# Altium schematic sheet Power2.SchDoc
size A3
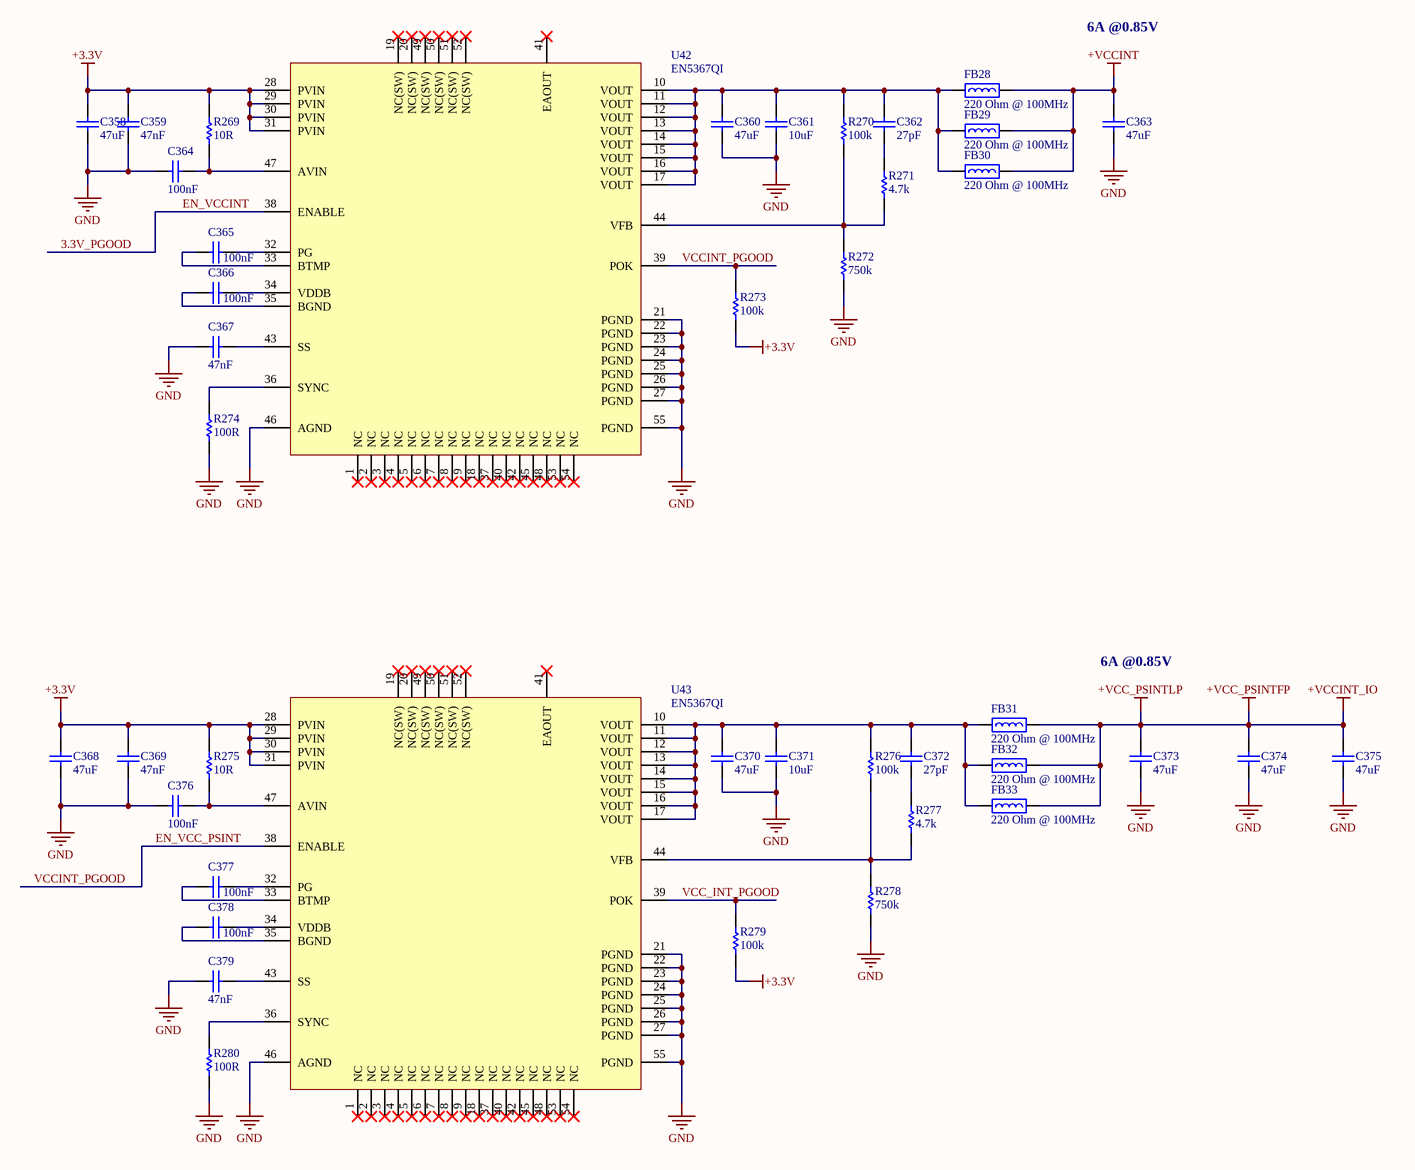
[diagram p0: Power2.SchDoc]

## Parts
C358  47uF  [CAPC3216L_1206]
C359  47nF  [CAPC2012L_0805]
C360  47uF  [CAPC3216L_1206]
C361  10uF  [CAPC1005L_0402]
C362  27pF  [CAPC1005L_0402]
C363  47uF  [CAPC3216L_1206]
C364  100nF  [CAPC1005L_0402]
C365  100nF  [CAPC1005L_0402]
C366  100nF  [CAPC1005L_0402]
C367  47nF  [CAPC2012L_0805]
C368  47uF  [CAPC3216L_1206]
C369  47nF  [CAPC2012L_0805]
C370  47uF  [CAPC3216L_1206]
C371  10uF  [CAPC1005L_0402]
C372  27pF  [CAPC1005L_0402]
C373  47uF  [CAPC3216L_1206]
C374  47uF  [CAPC3216L_1206]
C375  47uF  [CAPC3216L_1206]
C376  100nF  [CAPC1005L_0402]
C377  100nF  [CAPC1005L_0402]
C378  100nF  [CAPC1005L_0402]
C379  47nF  [CAPC2012L_0805]
FB28  Impedance @ Frequency: 220 Ohm @ 100MHz  [INDC1608N_0603]  (hidden comment: BEAD0603_220_2A5_40M)
FB29  Impedance @ Frequency: 220 Ohm @ 100MHz  [INDC1608N_0603]  (hidden comment: BEAD0603_220_2A5_40M)
FB30  Impedance @ Frequency: 220 Ohm @ 100MHz  [INDC1608N_0603]  (hidden comment: BEAD0603_220_2A5_40M)
FB31  Impedance @ Frequency: 220 Ohm @ 100MHz  [INDC1608N_0603]  (hidden comment: BEAD0603_220_2A5_40M)
FB32  Impedance @ Frequency: 220 Ohm @ 100MHz  [INDC1608N_0603]  (hidden comment: BEAD0603_220_2A5_40M)
FB33  Impedance @ Frequency: 220 Ohm @ 100MHz  [INDC1608N_0603]  (hidden comment: BEAD0603_220_2A5_40M)
R269  value 10R  [RESC1005L_0402]  (hidden comment: RES0402_10R_0W1_1T)
R270  value 100k  [RESC1005L_0402]  (hidden comment: RES0402_100K_0W2_1T)
R271  value 4.7k  [RESC1005L_0402]  (hidden comment: RES0402_4K7_0W1_1T)
R272  value 750k  [RESC1005L_0402]  (hidden comment: RES0402_750K_0W1_1T)
R273  value 100k  [RESC1005L_0402]  (hidden comment: RES0402_100K_0W2_1T)
R274  value 100R  [RESC1005L_0402]  (hidden comment: RES0402_100R_0W1_1T)
R275  value 10R  [RESC1005L_0402]  (hidden comment: RES0402_10R_0W1_1T)
R276  value 100k  [RESC1005L_0402]  (hidden comment: RES0402_100K_0W2_1T)
R277  value 4.7k  [RESC1005L_0402]  (hidden comment: RES0402_4K7_0W1_1T)
R278  value 750k  [RESC1005L_0402]  (hidden comment: RES0402_750K_0W1_1T)
R279  value 100k  [RESC1005L_0402]  (hidden comment: RES0402_100K_0W2_1T)
R280  value 100R  [RESC1005L_0402]  (hidden comment: RES0402_100R_0W1_1T)
U42  EN5367QI  [QFN54-EN5367QI]
U43  EN5367QI  [QFN54-EN5367QI]

## Nets
+3.3V: C358.2 C359.2 C368.2 C369.2 R269.2 R273.2 R275.2 R279.2 U42.28(PVIN) U42.29(PVIN) U42.30(PVIN) U42.31(PVIN) U43.28(PVIN) U43.29(PVIN) U43.30(PVIN) U43.31(PVIN)
+VCC_PSINTFP: C373.2 C374.2 C375.2 FB31.2 FB32.2 FB33.2  [also labelled +VCC_PSINTLP, +VCCINT_IO]
+VCCINT: C363.2 FB28.2 FB29.2 FB30.2
GND: C358.1 C359.1 C360.1 C361.1 C363.1 C364.2 C367.2 C368.1 C369.1 C370.1 C371.1 C373.1 C374.1 C375.1 C376.2 C379.2 R272.1 R274.2 R278.1 R280.2 U42.21(PGND) U42.22(PGND) U42.23(PGND) U42.24(PGND) U42.25(PGND) U42.26(PGND) U42.27(PGND) U42.46(AGND) U42.55(PGND) U43.21(PGND) U43.22(PGND) U43.23(PGND) U43.24(PGND) U43.25(PGND) U43.26(PGND) U43.27(PGND) U43.46(AGND) U43.55(PGND)
3.3V_PGOOD: U42.38(ENABLE)  [also labelled EN_VCCINT]
EN_VCC_PSINT: R273.1 U42.39(POK) U43.38(ENABLE)  [also labelled VCCINT_PGOOD]
VCC_INT_PGOOD: R279.1 U43.39(POK)
NetC360_2: C360.2 C361.2 C362.2 FB28.1 FB29.1 FB30.1 R270.2 U42.10(VOUT) U42.11(VOUT) U42.12(VOUT) U42.13(VOUT) U42.14(VOUT) U42.15(VOUT) U42.16(VOUT) U42.17(VOUT)
NetC362_1: C362.1 R271.2
NetC364_1: C364.1 R269.1 U42.47(AVIN)
NetC365_1: C365.1 U42.32(PG)
NetC365_2: C365.2 U42.33(BTMP)
NetC366_1: C366.1 U42.34(VDDB)
NetC366_2: C366.2 U42.35(BGND)
NetC367_1: C367.1 U42.43(SS)
NetC370_2: C370.2 C371.2 C372.2 FB31.1 FB32.1 FB33.1 R276.2 U43.10(VOUT) U43.11(VOUT) U43.12(VOUT) U43.13(VOUT) U43.14(VOUT) U43.15(VOUT) U43.16(VOUT) U43.17(VOUT)
NetC372_1: C372.1 R277.2
NetC376_1: C376.1 R275.1 U43.47(AVIN)
NetC377_1: C377.1 U43.32(PG)
NetC377_2: C377.2 U43.33(BTMP)
NetC378_1: C378.1 U43.34(VDDB)
NetC378_2: C378.2 U43.35(BGND)
NetC379_1: C379.1 U43.43(SS)
NetR270_1: R270.1 R271.1 R272.2 U42.44(VFB)
NetR274_1: R274.1 U42.36(SYNC)
NetR276_1: R276.1 R277.1 R278.2 U43.44(VFB)
NetR280_1: R280.1 U43.36(SYNC)

Not connected (* = marked no-connect by the designer): U42 1(NC)* 2(NC)* 3(NC)* 4(NC)* 5(NC)* 6(NC)* 7(NC)* 8(NC)* 9(NC)* 18(NC)* 19(NC(SW))* 20(NC(SW))* 37(NC)* 40(NC)* 41(EAOUT)* 42(NC)* 45(NC)* 48(NC)* 49(NC(SW))* 50(NC(SW))* 51(NC(SW))* 52(NC(SW))* 53(NC)* 54(NC)*; U43 1(NC)* 2(NC)* 3(NC)* 4(NC)* 5(NC)* 6(NC)* 7(NC)* 8(NC)* 9(NC)* 18(NC)* 19(NC(SW))* 20(NC(SW))* 37(NC)* 40(NC)* 41(EAOUT)* 42(NC)* 45(NC)* 48(NC)* 49(NC(SW))* 50(NC(SW))* 51(NC(SW))* 52(NC(SW))* 53(NC)* 54(NC)*

## Notes on the sheet
- 6A @0.85V

## Library data of the parts
C358 C360 C363 C368 C370 C373-C375 = CAPCER1206X5R47U25V_20T: CAP CER 47UF 25V X5R 1206; Manufacturer 1: TDK Corporation; Manufacturer Part Number 1: C3216X5R1E476M160AC; Tolerance: 20%; Package: 1206; ComponentLink1Description: Datasheet; Value: 47uF; Voltage: 25V; Temperature Coefficient: X5R; Supplier 1: Digi-Key; Supplier Part Number 1: 445-8047-1-ND; Operating Temperature: -55°C ~ 85°C
C359 C367 C369 C379 = CAPCER0805X5R47N50V_10T: CAP CER 0.047UF 50V X7R 0805; Manufacturer 1: Kemet; Manufacturer Part Number 1: C0805C473K5RACTU; Tolerance: 10%; Package: 0805; ComponentLink1Description: Datasheet; Value: 47nF; Voltage: 50V; Temperature Coefficient: X7R; Supplier 1: Digi-Key; Supplier Part Number 1: 399-1166-1-ND; Operating Temperature: -55°C ~ 125°C
C361 C371 = CAPCER0402X5R10U10V_20T: CAP CER 10UF 10V X5R 0402; Manufacturer 1: Samsung Electro-Mechanics America, Inc.; Manufacturer Part Number 1: CL05A106MP5NUNC; Tolerance: 20%; Package: 0402; ComponentLink1Description: Datasheet; Value: 10uF; Voltage: 10V; Temperature Coefficient: X5R; Supplier 1: Digi-Key; Supplier Part Number 1: 1276-1450-1-ND; Operating Temperature: -55°C ~ 85°C
C362 C372 = CAPCER0402C0G27P50V_5T: CAP CER 27PF 50V C0G/NP0 0402; Manufacturer 1: Murata Electronics North America; Manufacturer Part Number 1: GRM1555C1H270JA01D; Tolerance: 5%; Package: 0402; ComponentLink1Description: Datasheet; Value: 27pF; Voltage: 50V; Temperature Coefficient: C0G/NP0; Supplier 1: Digi-Key; Supplier Part Number 1: 490-5869-1-ND; Operating Temperature: -55°C ~ 125°C
C364-C366 C376-C378 = CAPCER0402X7R100N25V_10T: CAP CER 0.1UF 25V X7R 0402; Manufacturer 1: Murata Electronics North America; Manufacturer Part Number 1: GRM155R71E104KE14D; Tolerance: 10%; Package: 0402; ComponentLink1Description: Datasheet; Value: 100nF; Voltage: 25V; Temperature Coefficient: X7R; Supplier 1: Digi-Key; Supplier Part Number 1: 490-10698-1-ND; Operating Temperature: -55°C ~ 125°C
FB28-FB33 = BEAD0603_220_2A5_40M: FERRITE BEAD 220 OHM 0603 1LN; Manufacturer 1: Murata Electronics North America; Manufacturer Part Number 1: BLM18SG221TN1D; Current Rating (Max): 2.5A; DC Resistance (DCR) (Max): 40 mohm; Package: 0603; ComponentLink1Description: Datasheet; ComponentLink1URL: C:\Users\Public\Documents\Altium\AD16\Library\PDF\ENFA0003.pdf; Supplier 1: Digi-Key; Supplier Part Number 1: 490-5225-1-ND; Operating Temperature: -55°C ~ 125°C
R269 R275 = RES0402_10R_0W1_1T: RES SMD 10 OHM 1% 1/10W 0402; Manufacturer 1: Panasonic Electronic Components; Manufacturer Part Number 1: ERJ-2RKF10R0X; Package: 0402; ComponentLink1Description: Datasheet; Power: 1/10W; Tolerance: 1%; Supplier 1: Digi-Key; Supplier Part Number 1: P10.0LCT-ND
R270 R273 R276 R279 = RES0402_100K_0W2_1T: RES SMD 100K OHM 1% 1/5W 0402; Manufacturer 1: Vishay Dale; Manufacturer Part Number 1: RCS0402100KFKED; Package: 0402; ComponentLink1Description: Datasheet; Power: 1/5W; Tolerance: 1%; Supplier 1: Digi-Key; Supplier Part Number 1: 541-2899-1-ND
R271 R277 = RES0402_4K7_0W1_1T: RES SMD 4.7K OHM 1% 1/10W 0402; Manufacturer 1: Panasonic Electronic Components; Manufacturer Part Number 1: ERJ-2RKF4701X; Package: 0402; ComponentLink1Description: Datasheet; Power: 1/10W; Tolerance: 1%; Supplier 1: Digi-Key; Supplier Part Number 1: P4.70KLCT-ND
R272 R278 = RES0402_750K_0W1_1T: RES SMD 750K OHM 1% 1/10W 0402; Manufacturer 1: Panasonic Electronic Components; Manufacturer Part Number 1: ERJ-2RKF7503X; Package: 0402; ComponentLink1Description: Datasheet; Power: 1/10W; Tolerance: 1%; Supplier 1: Digi-Key; Supplier Part Number 1: P750KLCT-ND
R274 R280 = RES0402_100R_0W1_1T: RES SMD 100 OHM 1% 1/10W 0402; Manufacturer 1: Panasonic Electronic Components; Manufacturer Part Number 1: ERJ-2RKF1000X; Package: 0402; ComponentLink1Description: Datasheet; Power: 1/10W; Tolerance: 1%; Supplier 1: Digi-Key; Supplier Part Number 1: P100LCT-ND
U42 U43 = EN5367QI: DC/DC CONVERTER 0.6-4.9V 29W; Manufacturer 1: Altera; Voltage - Output: 0.6 ~ 4.9 V; Voltage - Input: 2.5V - 5.5V; ComponentLink1Description: Datasheet; ComponentLink1URL: C:\Users\Public\Documents\Altium\AD16\Library\PDF\en5367qi_07013.pdf; Supplier 1: Digi-Key; Supplier Part Number 1: 544-2858-1-ND; Manufacturer Part Number 1: EN5367QI; Operating Temperature: -40°C ~ 85°C